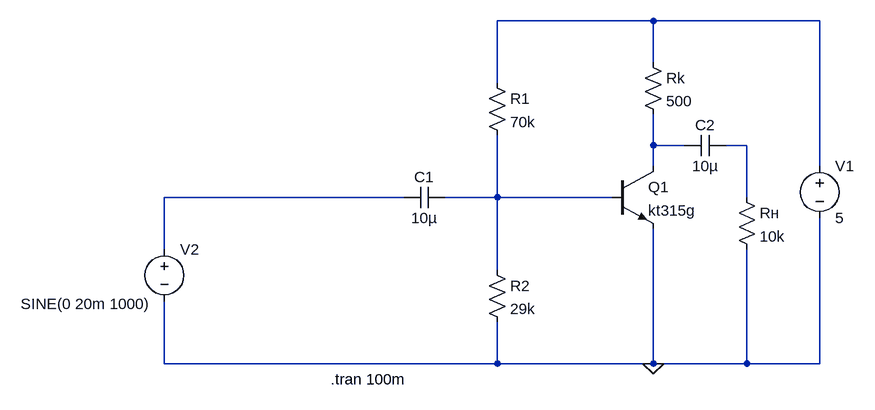
[diagram p0: schematic Common-emitter amplifier.asc]
Common-emitter amplifier.asc, the LTspice schematic file:
Version 4
SHEET 1 1100 680
WIRE 224 -112 -16 -112
WIRE 480 -112 224 -112
WIRE 224 -48 224 -112
WIRE -16 -16 -16 -112
WIRE 224 80 224 32
WIRE 272 80 224 80
WIRE 368 80 336 80
WIRE 224 112 224 80
WIRE 480 112 480 -112
WIRE -160 160 -528 160
WIRE -16 160 -16 64
WIRE -16 160 -96 160
WIRE 160 160 -16 160
WIRE 368 160 368 80
WIRE -528 240 -528 160
WIRE -16 272 -16 160
WIRE -528 416 -528 320
WIRE -16 416 -16 352
WIRE -16 416 -528 416
WIRE 224 416 224 208
WIRE 224 416 -16 416
WIRE 368 416 368 240
WIRE 368 416 224 416
WIRE 480 416 480 192
WIRE 480 416 368 416
FLAG 224 416 0
SYMBOL voltage 480 96 R0
WINDOW 123 0 0 Left 0
WINDOW 39 0 0 Left 0
SYMATTR InstName V1
SYMATTR Value 5
SYMBOL res 208 -64 R0
SYMATTR InstName Rk
SYMATTR Value 500
SYMBOL res -32 -32 R0
SYMATTR InstName R1
SYMATTR Value 70k
SYMBOL res -32 256 R0
SYMATTR InstName R2
SYMATTR Value 29k
SYMBOL voltage -528 224 R0
WINDOW 3 -221 100 Left 2
WINDOW 123 0 0 Left 0
WINDOW 39 0 0 Left 0
SYMATTR Value SINE(0 20m 1000)
SYMATTR InstName V2
SYMBOL cap -96 144 R90
WINDOW 0 0 32 VBottom 2
WINDOW 3 32 32 VTop 2
SYMATTR InstName C1
SYMATTR Value 10µ
SYMBOL cap 336 64 R90
WINDOW 0 0 32 VBottom 2
WINDOW 3 32 32 VTop 2
SYMATTR InstName C2
SYMATTR Value 10µ
SYMBOL res 352 144 R0
SYMATTR InstName Rн
SYMATTR Value 10k
SYMBOL npn 160 112 R0
SYMATTR InstName Q1
SYMATTR Value kt315g
TEXT -272 440 Left 2 !.tran 100m

The netlist it stands for:
* Common-emitter amplifier.asc
V1 N001 0 5
Rk N001 N002 500
R1 N001 N005 70k
R2 N005 0 29k
V2 N004 0 SINE(0 20m 1000)
C1 N005 N004 10µ
C2 N003 N002 10µ
Rн N003 0 10k
Q1 N002 N005 0 0 kt315g
.model NPN NPN
.model PNP PNP
.lib standard.bjt
.tran 100m
.backanno
.end